# Altium schematic sheet Inputs.SchDoc
size A4
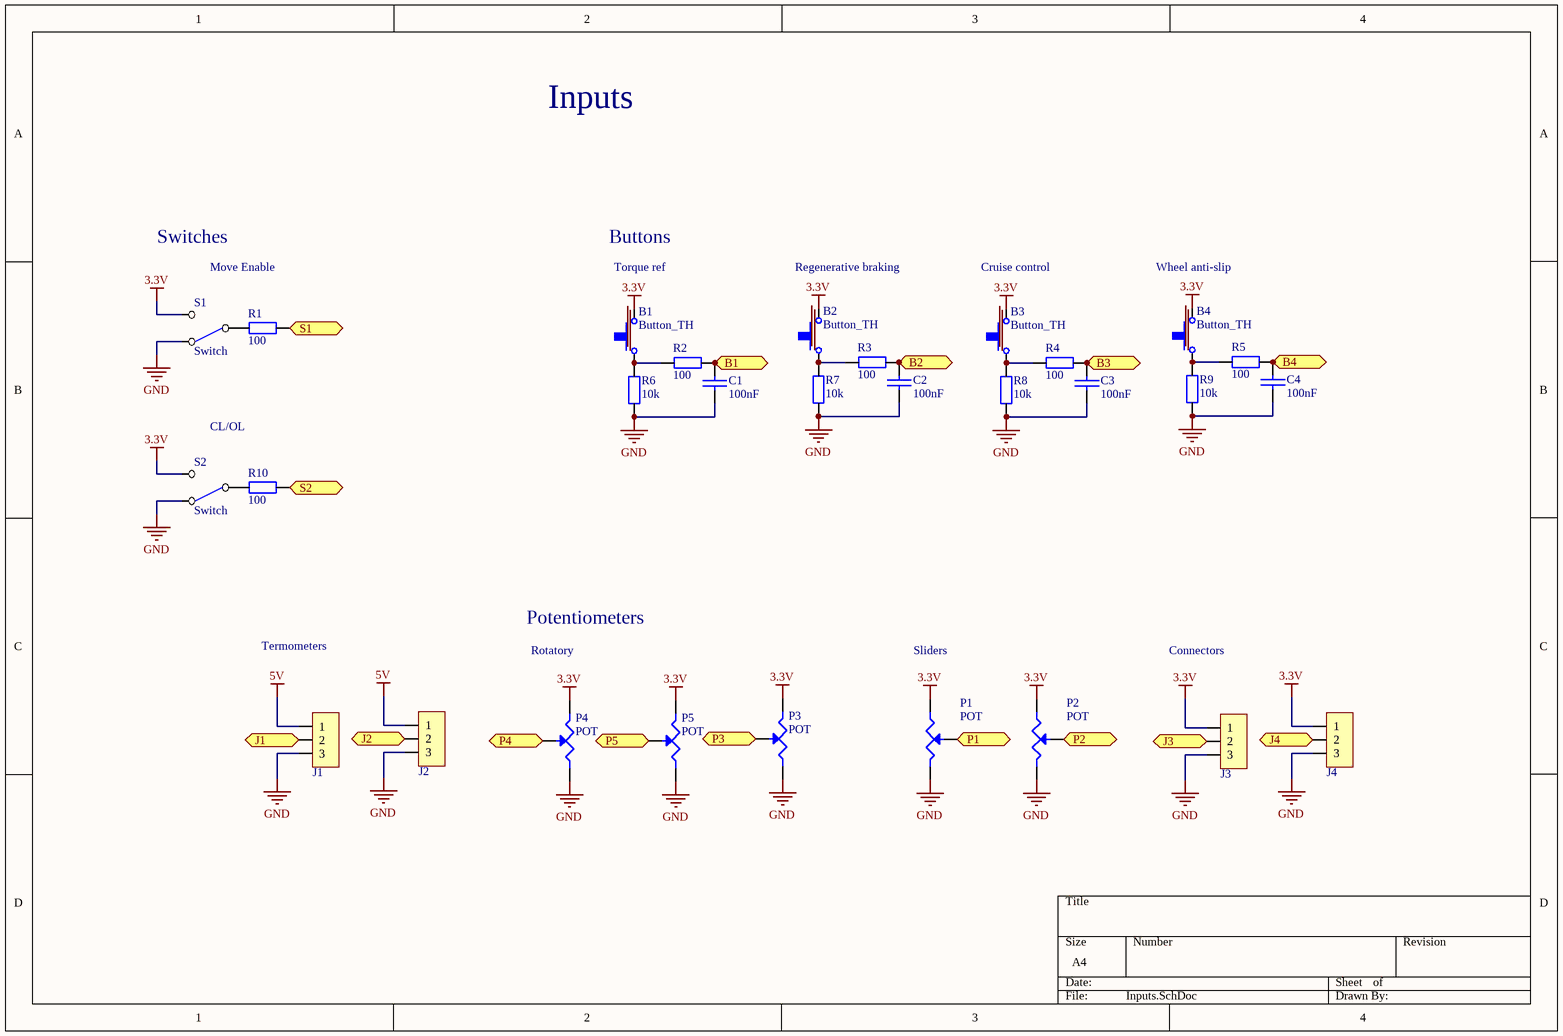
[diagram p0: Inputs.SchDoc]

## Parts
B1  Button_TH  [ButtonTH]
B2  Button_TH  [ButtonTH]
B3  Button_TH  [ButtonTH]
B4  Button_TH  [ButtonTH]
C1  100nF  [1206]
C2  100nF  [1206]
C3  100nF  [1206]
C4  100nF  [1206]
J1  Cleva 2 vias  [Con3_KK_256]  (value not drawn)
J2  Cleva 2 vias  [Con3_KK_256]  (value not drawn)
J3  Cleva 2 vias  [Con3_KK_256]  (value not drawn)
J4  Cleva 2 vias  [Con3_KK_256]  (value not drawn)
P1  POT  [SliderPot_PTA6044]
P2  POT  [SliderPot_PTA6044]
P3  POT  [POT_RK11K1140A3L]
P4  POT  [POT_RK11K1140A3L]
P5  POT  [POT_RK11K1140A3L]
R1  100  [1206]
R2  100  [1206]
R3  100  [1206]
R4  100  [1206]
R5  100  [1206]
R6  10k  [1206]
R7  10k  [1206]
R8  10k  [1206]
R9  10k  [1206]
R10  100  [1206]
S1  Switch  [SwitchTH_2Pos]
S2  Switch  [SwitchTH_2Pos]

## Ports
B1, B2, B3, B4, J1, J2, J3, J4, P1, P2, P3, P4, P5, S1, S2

## Nets
3.3V: B1.0 B2.0 B3.0 B4.0 J3.1 J4.1 P1.1 P2.1 P3.3 P4.3 P5.3 S1.2(ON2) S2.2(ON2)
5V: J1.1 J2.1
GND: C1.2 C2.2 C3.2 C4.2 J1.3 J2.3 J3.3 J4.3 P1.3 P2.3 P3.1 P4.1 P5.1 R6.2 R7.2 R8.2 R9.2 S1.0(ON1) S2.0(ON1)
B1: C1.1 R2.1 ; port B1
B2: C2.1 R3.1 ; port B2
B3: C3.1 R4.1 ; port B3
B4: C4.1 R5.1 ; port B4
J1: J1.2 ; port J1
J2: J2.2 ; port J2
J3: J3.2 ; port J3
J4: J4.2 ; port J4
P1: P1.2 ; port P1
P2: P2.2 ; port P2
P3: P3.2 ; port P3
P4: P4.2 ; port P4
P5: P5.2 ; port P5
S1: R1.2 ; port S1
S2: R10.2 ; port S2
NetB1_1: B1.1 R2.2 R6.1
NetB2_1: B2.1 R3.2 R7.1
NetB3_1: B3.1 R4.2 R8.1
NetB4_1: B4.1 R5.2 R9.1
NetR1_1: R1.1 S1.1(COMMON)
NetR10_1: R10.1 S2.1(COMMON)

## Notes on the sheet
- Inputs
- Switches
- Buttons
- Move Enable
- (near B1) Torque ref
- (near B2) Regenerative braking
- (near B3) Cruise control
- (near B4) Wheel anti-slip
- CL/OL
- Termometers
- Potentiometers
- Rotatory
- (near P1) Sliders
- Connectors

## Library data of the parts
C1-C4 = Condensador
J1-J4 = Con_3
P1-P5 = POT: POTENCIOMETRO
R1-R10 = Resistencia: Potencia: 1/4W